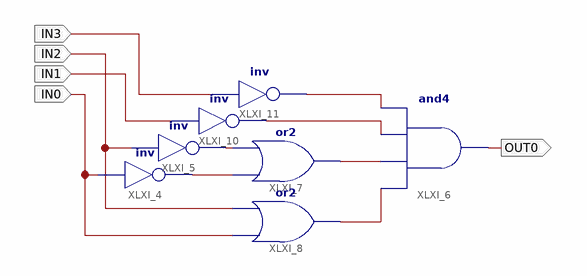
[diagram p0: schematic sheet 1]
// Xilinx ISE schematic Segmento0.sch (spartan3e) as structural Verilog: 7 symbols, 5 ports
module Segmento0 (
  input  IN2,
  input  IN0,
  input  IN3,
  input  IN1,
  output OUT0
);

  wire XLXN_16, XLXN_17, XLXN_21, XLXN_34, XLXN_36, XLXN_39;

  not XLXI_4 (XLXN_21, IN0);
  not XLXI_5 (XLXN_34, IN2);
  and XLXI_6 (OUT0, XLXN_17, XLXN_16, XLXN_39, XLXN_36);
  or XLXI_7 (XLXN_16, XLXN_21, XLXN_34);
  or XLXI_8 (XLXN_17, IN0, IN2);
  not XLXI_10 (XLXN_39, IN1);
  not XLXI_11 (XLXN_36, IN3);
endmodule
